# Altium schematic sheet Analog.SchDoc
size A
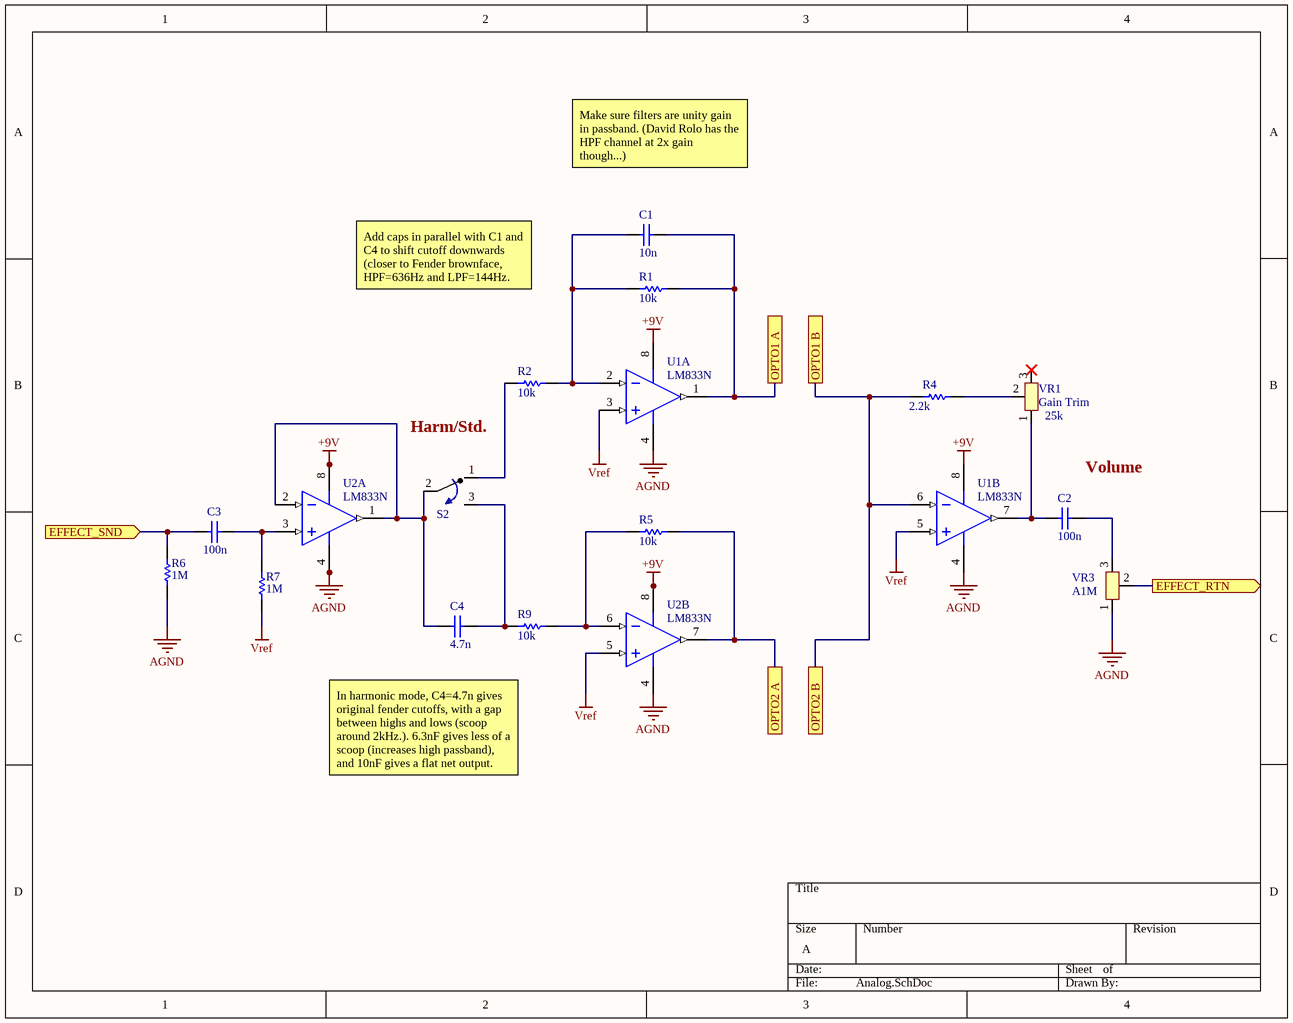
[diagram p0: Analog.SchDoc]

## Parts
C1  value 10n  [RAD-0.3]  (hidden comment: Cap)
C2  value 100n  [RAD-0.3]  (hidden comment: Cap)
C3  value 100n  [RAD-0.3]  (hidden comment: Cap)
C4  value 4.7n  [RAD-0.3]  (hidden comment: Cap)
R1  value 10k  [AXIAL-0.3]  (hidden comment: Res1)
R2  value 10k  [AXIAL-0.3]  (hidden comment: Res1)
R4  value 2.2k  [AXIAL-0.3]  (hidden comment: Res1)
R5  value 10k  [AXIAL-0.3]  (hidden comment: Res1)
R6  value 1M  [AXIAL-0.3]  (hidden comment: Res1)
R7  value 1M  [AXIAL-0.3]  (hidden comment: Res1)
R9  value 10k  [AXIAL-0.3]  (hidden comment: Res1)
S2  SPDT Toggle  [SPDT Toggle]  (value not drawn)
U1  LM833N  [626-05]  (parts A,B of 2)
U2  LM833N  [626-05]  (parts A,B of 2)
VR1  Gain Trim  value 25k  [Trimpot - Bourns]
VR3  value A1M  [Pot-16mm]  (hidden comment: Pot-16mm)

## Ports
EFFECT_RTN (out), EFFECT_SND (in), OPTO1 A, OPTO1 B, OPTO2 A, OPTO2 B

## Nets
+9V: U1.8(V+) U2.8(V+)
AGND: R6.1 U1.4(V-) U2.4(V-) VR3.1
Vref: R7.1 U1.3(IN+) U1.5(IN+) U2.5(IN+)
EFFECT_RTN: VR3.2 ; port EFFECT_RTN
EFFECT_SND: C3.1 R6.2 ; port EFFECT_SND
OPTO1 A: C1.1 R1.1 U1.1(OUT) ; port OPTO1 A
OPTO1 B: R4.2 U1.6(IN-) ; port OPTO1 B, port OPTO2 B
OPTO2 A: R5.1 U2.7(OUT) ; port OPTO2 A
NetC1_2: C1.2 R1.2 R2.1 U1.2(IN-)
NetC2_1: C2.1 VR3.3
NetC2_2: C2.2 U1.7(OUT) VR1.1
NetC3_2: C3.2 R7.2 U2.3(IN+)
NetC4_1: C4.1 R9.2 S2.3
NetC4_2: C4.2 S2.2 U2.1(OUT) U2.2(IN-)
NetR2_2: R2.2 S2.1
NetR4_1: R4.1 VR1.2
NetR5_2: R5.2 R9.1 U2.6(IN-)

Not connected (* = marked no-connect by the designer): VR1 3*

## Notes on the sheet
- Make sure filters are unity gain in passband. (David Rolo has the HPF channel at 2x gain though...)
- Add caps in parallel with C1 and C4 to shift cutoff downwards (closer to Fender brownface, HPF=636Hz and LPF=144Hz.
- Harm/Std.
- (near C2) Volume
- In harmonic mode, C4=4.7n gives original fender cutoffs, with a gap between highs and lows (scoop around 2kHz.). 6.3nF gives less of a scoop (increases high passband), and 10nF gives a flat net output.

## Library data of the parts
C1-C4 = Cap: Capacitor; Published: 8-Jun-2000; LatestRevisionDate: 17-Jul-2002; LatestRevisionNote: Re-released for DXP Platform.; PackageReference: RAD-0.3; Publisher: Altium Limited; PackageDescription: Radial Cap, Thru-Hole; 2 Leads; 0.3 in Pin Spacing
R1 R2 R4-R7 R9 = Res1: Resistor; Published: 8-Jun-2000; LatestRevisionDate: 17-Jul-2002; LatestRevisionNote: Re-released for DXP Platform.; PackageReference: AXIAL-0.3; Publisher: Altium Limited; PackageDescription: Axial Device, Thru-Hole; 2 Leads; 0.3 in Pin Spacing
U1 U2 = LM833N: Low-Noise, Audio Dual Operational Amplifier; Published: 28-Feb-2003; DatasheetVersion: Jan-2002, Rev. 2; PackageVersion: 1998; PackageReference: 626-05; Publisher: Altium Limited; PackageDescription: DIP; 8 Leads; Row Spacing 7.62 mm; Pitch 2.54 mm; ComponentLink1Description: Manufacturer Link; ComponentLink1URL: http://www.onsemi.com/; ComponentLink2Description: Datasheet; ComponentLink2URL: http://www.onsemi.com/pub/Collateral/LM833-D.PDF
VR1 = Trimpot - Bourns